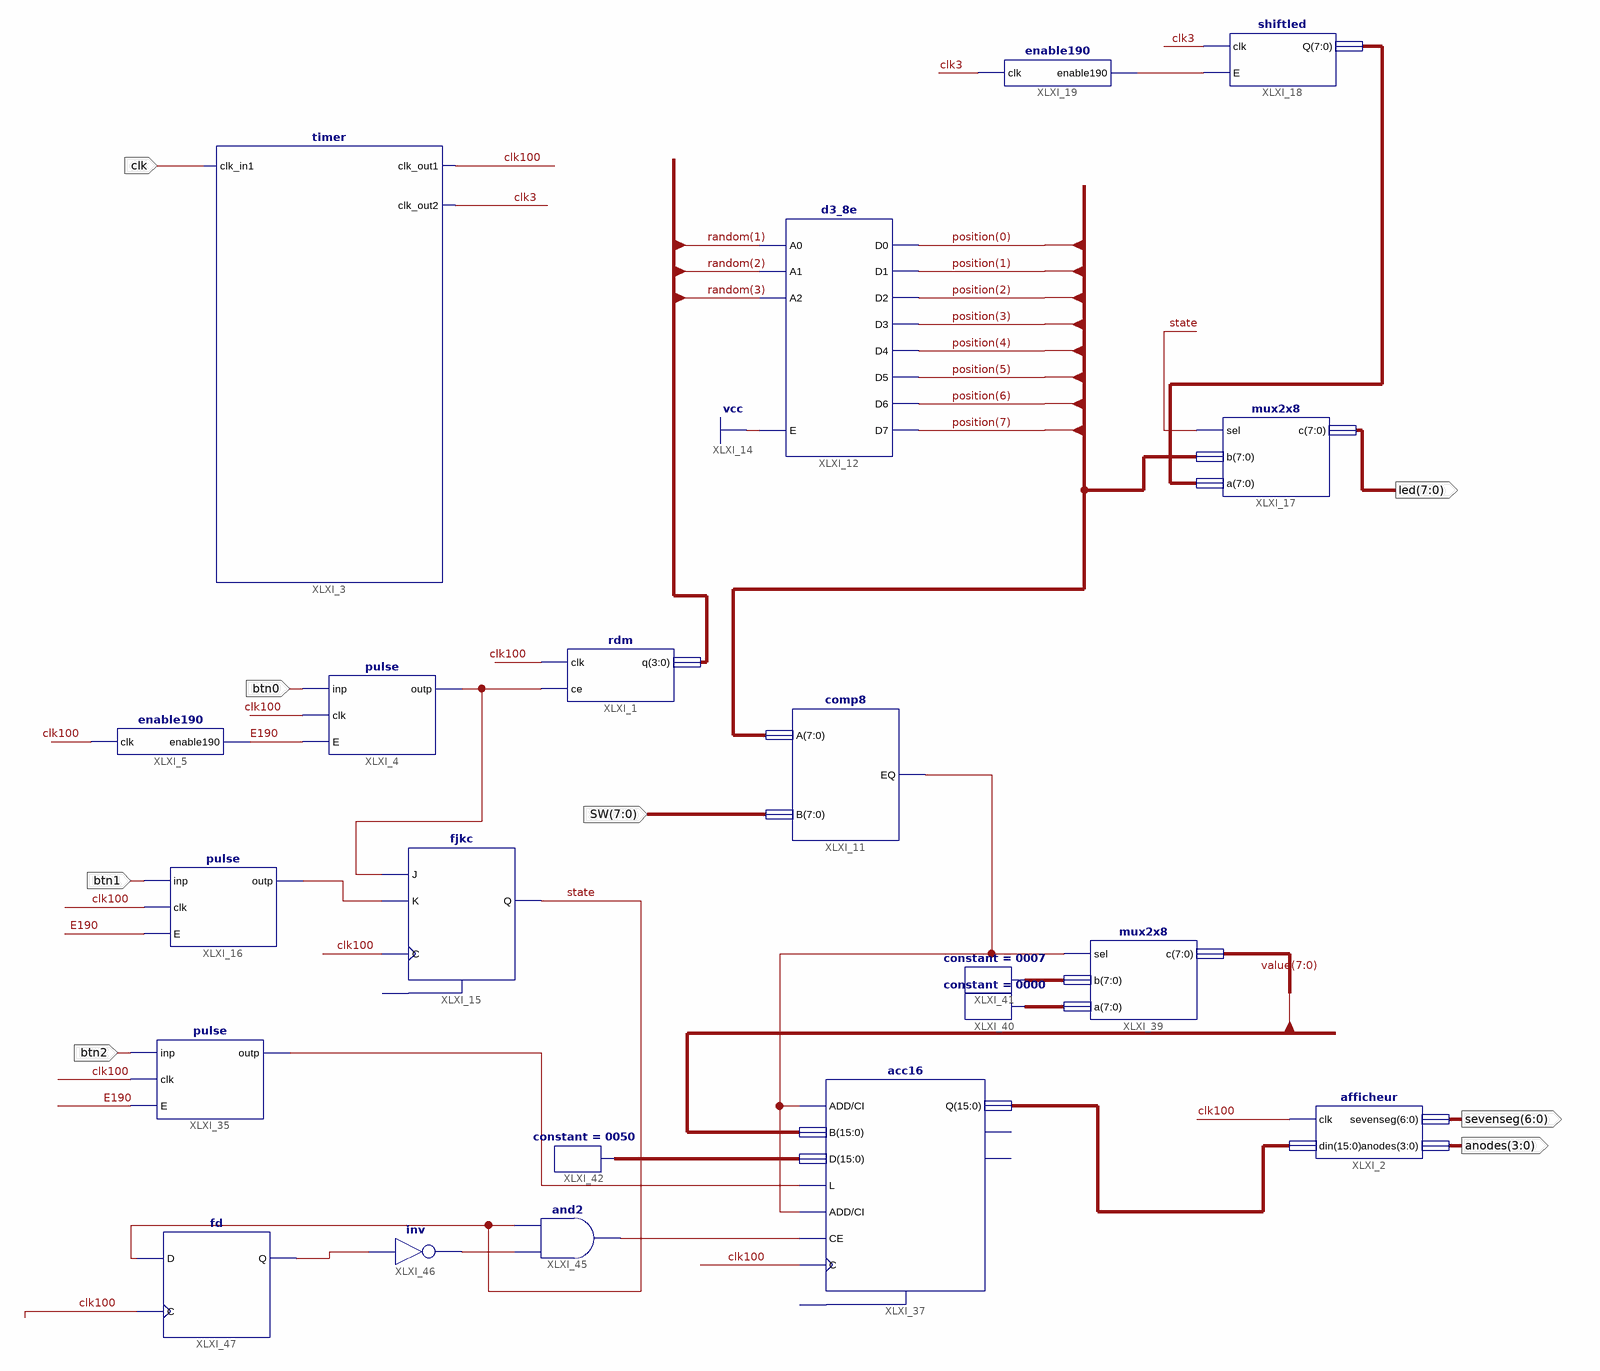
[diagram p0: schematic sheet 1]
// Xilinx ISE schematic toplevel.sch (spartan6) as structural Verilog: 21 symbols, 8 ports
module toplevel (
  input  clk,
  input  btn0,
  input  [7:0] SW,
  input  btn1,
  input  btn2,
  output [7:0] led,
  output [6:0] sevenseg,
  output [3:0] anodes
);

  wire clk3, clk100, E190, state, XLXN_52, XLXN_53, XLXN_61, XLXN_136, XLXN_137, XLXN_140, XLXN_144, XLXN_146;
  wire [3:0] random;
  wire [7:0] position, XLXN_64, XLXN_148, XLXN_149;
  wire [15:0] value, XLXN_46, XLXN_127;

  timer XLXI_3 (.clk_in1(clk), .clk_out1(clk100), .clk_out2(clk3));
  pulse XLXI_4 (.inp(btn0), .clk(clk100), .E(E190), .outp(XLXN_53));
  enable190 XLXI_5 (.clk(clk100), .enable190(E190));
  comp8 XLXI_11 (.A(position), .B(SW), .EQ(XLXN_140));
  rdm XLXI_1 (.clk(clk100), .ce(XLXN_53), .q(random));
  d3_8e XLXI_12 (
    .A0(random[1]), .A1(random[2]), .A2(random[3]), .E(1'b1), .D0(position[0]), .D1(position[1]),
    .D2(position[2]), .D3(position[3]), .D4(position[4]), .D5(position[5]), .D6(position[6]), .D7(position[7]));
  fjkc XLXI_15 (.C(clk100), .J(XLXN_53), .K(XLXN_52), .Q(state));  // open: CLR
  pulse XLXI_16 (.inp(btn1), .clk(clk100), .E(E190), .outp(XLXN_52));
  mux2x8 XLXI_17 (.sel(state), .b(position), .a(XLXN_64), .c(led));
  shiftled XLXI_18 (.clk(clk3), .E(XLXN_61), .Q(XLXN_64));
  enable190 XLXI_19 (.clk(clk3), .enable190(XLXN_61));
  pulse XLXI_35 (.inp(btn2), .clk(clk100), .E(E190), .outp(XLXN_136));
  acc16 XLXI_37 (
    .ADD(XLXN_140), .B(value), .C(clk100), .CE(XLXN_137), .CI(XLXN_140), .D(XLXN_127), .L(XLXN_136),
    .Q(XLXN_46));  // open: R, CO, OFL
  mux2x8 XLXI_39 (.sel(XLXN_140), .b(XLXN_149), .a(XLXN_148), .c(value[7:0]));
  constant #(.CValue("0000")) XLXI_40 (.O(XLXN_148));
  constant #(.CValue("0007")) XLXI_41 (.O(XLXN_149));
  constant #(.CValue("0050")) XLXI_42 (.O(XLXN_127));
  afficheur XLXI_2 (.clk(clk100), .din(XLXN_46), .sevenseg(sevenseg), .anodes(anodes));
  and XLXI_45 (XLXN_137, XLXN_144, state);
  not XLXI_46 (XLXN_144, XLXN_146);
  fd XLXI_47 (.C(clk100), .D(state), .Q(XLXN_146));
endmodule
